# Altium schematic sheet RGB_Displays.SchDoc: Apalis Evaluation Board 1.1
size A3; Organization: Toradex AG; Address1: Altsagenstrasse 5; Address2: Horw; Address3: 6048; Address4: Switzerland; DocumentNumber: 18; Revision: V1.1; SheetNumber: 18; SheetTotal: 32; PageSetup: Record=PageOptions|CenterHorizontal=True|CenterVertical=True|PrintScale=0.73|XCorrection=1.00|YCorrection=1.00|PrintKind=0|BorderSize=5000000|LeftOffset=0|BottomOffset=0|Orientation=2|PaperLength=1000|PaperWidth=1000|Scale=100|PaperSource=7|PrintQuality=-4|MediaType=1|DitherType=10|PaperKind=A4|PrintScaleMode=1
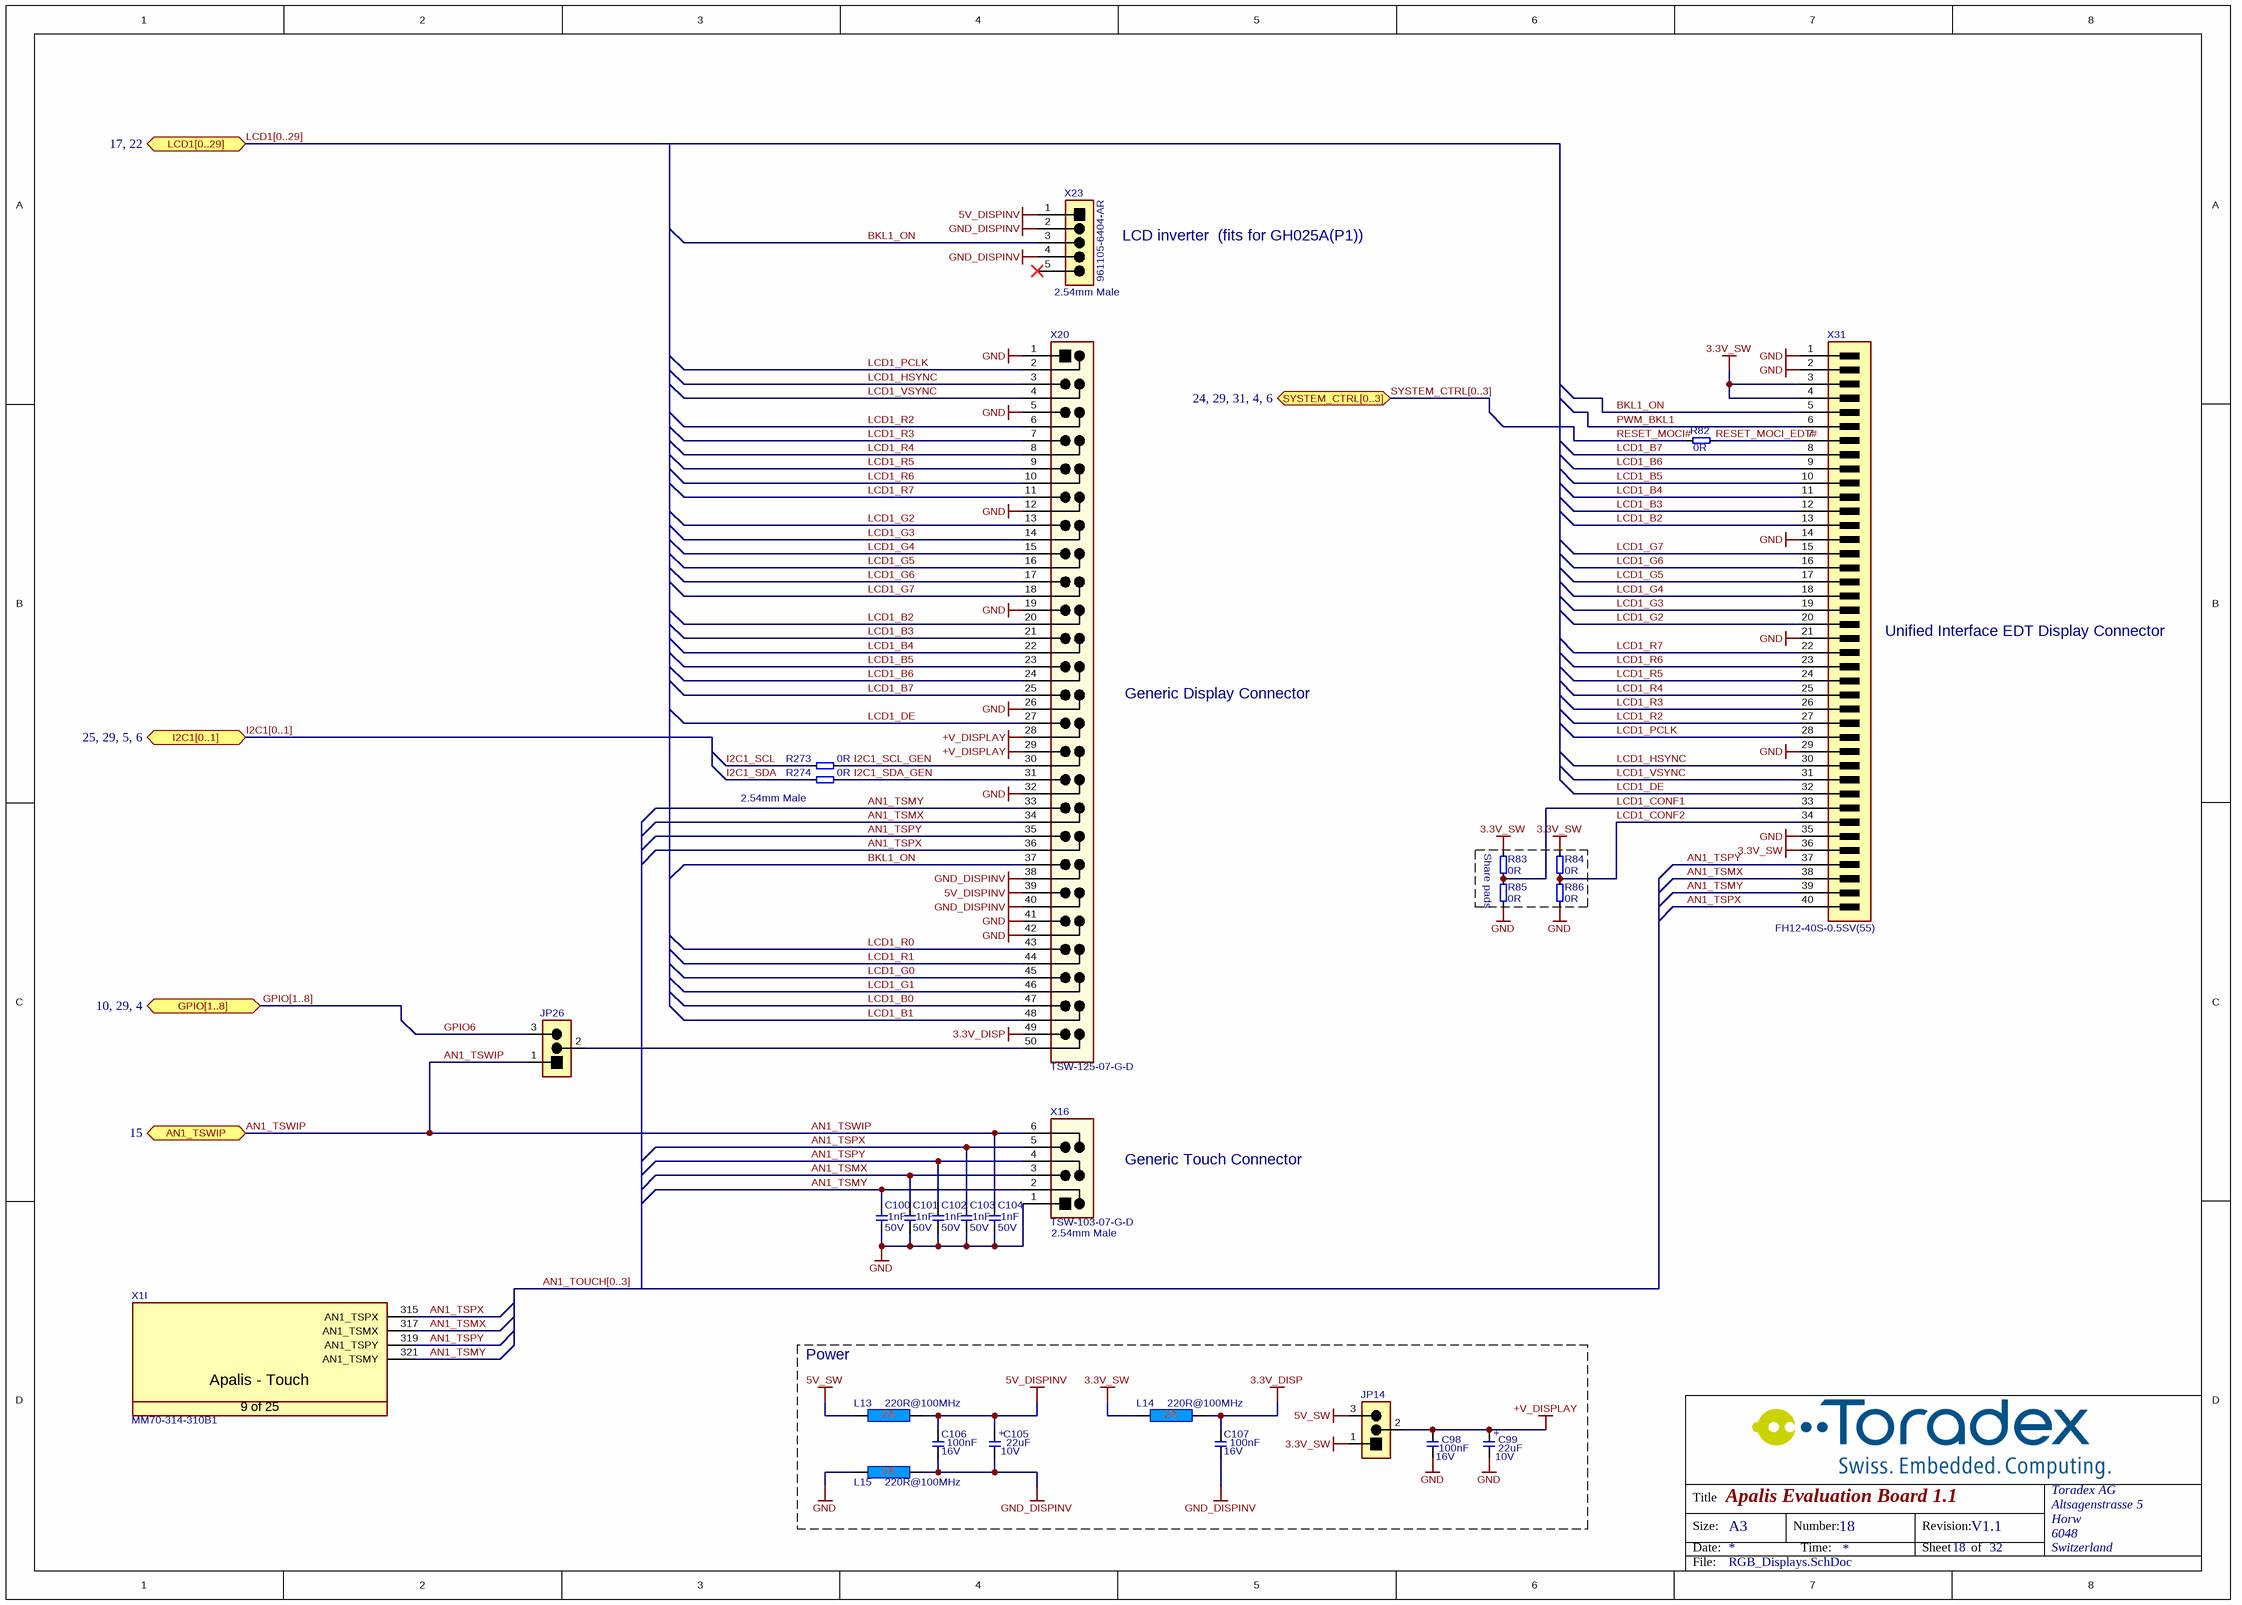
[diagram p0: RGB_Displays.SchDoc]

## Parts
C98  Rating: 16V  [T_CAPC0603X33N]  (hidden comment: 100nF)
C99  Rating: 10V  [CAPMP3528X210N]  (hidden comment: 22uF)
C100  Rating: 50V  [T_CAPC0603X33N]  (hidden comment: 1nF)
C101  Rating: 50V  [T_CAPC0603X33N]  (hidden comment: 1nF)
C102  Rating: 50V  [T_CAPC0603X33N]  (hidden comment: 1nF)
C103  Rating: 50V  [T_CAPC0603X33N]  (hidden comment: 1nF)
C104  Rating: 50V  [T_CAPC0603X33N]  (hidden comment: 1nF)
C105  Rating: 10V  [CAPMP3528X210N]  (hidden comment: 22uF)
C106  Rating: 16V  [T_CAPC0603X33N]  (hidden comment: 100nF)
C107  Rating: 16V  [T_CAPC0603X33N]  (hidden comment: 100nF)
JP14  826936-3  [T_TYCO_826936-3]  (value not drawn)
JP26  826936-3  [T_TYCO_826936-3]  (value not drawn)
L13  220R@100MHz  [INDC1608X95N]
L14  220R@100MHz  [INDC1608X95N]
L15  220R@100MHz  [INDC1608X95N]
R82  0R  [T_RESC0603X30N]
R83  0R  [T_RESC0603X30N]
R84  0R  [T_RESC0603X30N]
R85  0R  [T_RESC0603X30N]
R86  0R  [T_RESC0603X30N]
R273  0R  [T_RESC0603X30N]
R274  0R  [T_RESC0603X30N]
X1  Manufacturer Part No.: MM70-314-310B1  [T_JAE_MM70-314-310B1]  (hidden comment: CON-JAE-MM70-314-310B1-314-0.5mm)  (part I of 25)
X16  TSW-103-07-G-D  [T_Samtec_TSW-103-07-G-D]
X20  TSW-125-07-G-D  [T_SAMTEC_TSW-125-07-G-D]
X23  961105-6404-AR  [T_3M_961105-6404-AR]
X31  FH12-40S-0.5SV(55)  [T_Hirose_FH12-40S-0.5SV(55)]

## Blocks framed on the sheet
Share pads: R83-R86
Power: C98 C99 C105-C107 JP14 L13-L15

## Ports
AN1_TSWIP (bidir, see 15), GPIO[1..8] (bidir, see 10, 29, 4), I2C1[0..1] (bidir, see 25, 29, 5, 6), LCD1[0..29] (bidir, see 17, 22), SYSTEM_CTRL[0..3] (bidir, see 24, 29, 31, 4, 6)

## Nets
3.3V_DISP: C107.2 L14.2 X20.49
3.3V_SW: JP14.1 L14.1 R83.1 R84.1 X31.3(VCC) X31.4(VCC) X31.36(VDD)
5V_DISPINV: C105.1 C106.2 L13.2 X20.39 X23.1
5V_SW: JP14.3 L13.1
+V_DISPLAY: C98.2 C99.1 JP14.2 X20.28 X20.29
GND: C98.1 C99.2 C100.1 C101.1 C102.1 C103.1 C104.1 L15.1 R85.2 R86.1 X16.1 X20.1 X20.5 X20.12 X20.19 X20.26 X20.32 X20.41 X20.42 X31.1(VSS) X31.2(VSS) X31.14(VSS) X31.21(VSS) X31.29(VSS) X31.35(VSS)
GND_DISPINV: C105.2 C106.1 C107.1 L15.2 X20.38 X20.40 X23.2 X23.4
AN1_TSMX: C101.2 X1.317(AN1_TSMX) X16.3 X20.34 X31.38(XR)
AN1_TSMY: C100.2 X1.321(AN1_TSMY) X16.2 X20.33 X31.39(YD)
AN1_TSPX: C103.2 X1.315(AN1_TSPX) X16.5 X20.36 X31.40(XL)
AN1_TSPY: C102.2 X1.319(AN1_TSPY) X16.4 X20.35 X31.37(YU)
AN1_TSWIP: C104.2 JP26.1 X16.6 ; port AN1_TSWIP
BKL1_ON: X20.37 X23.3 X31.5(PWCTRL)
GPIO6: JP26.3
I2C1_SCL: R273.1
I2C1_SCL_GEN: R273.2 X20.30
I2C1_SDA: R274.1
I2C1_SDA_GEN: R274.2 X20.31
LCD1_B0: X20.47
LCD1_B1: X20.48
LCD1_B2: X20.20 X31.13(B0)
LCD1_B3: X20.21 X31.12(B1)
LCD1_B4: X20.22 X31.11(B2)
LCD1_B5: X20.23 X31.10(B3)
LCD1_B6: X20.24 X31.9(B4)
LCD1_B7: X20.25 X31.8(B5)
LCD1_CONF1: R83.2 R85.1 X31.33(NC)
LCD1_CONF2: R84.2 R86.2 X31.34(SHUT)
LCD1_DE: X20.27 X31.32(ENB)
LCD1_G0: X20.45
LCD1_G1: X20.46
LCD1_G2: X20.13 X31.20(G0)
LCD1_G3: X20.14 X31.19(G1)
LCD1_G4: X20.15 X31.18(G2)
LCD1_G5: X20.16 X31.17(G3)
LCD1_G6: X20.17 X31.16(G4)
LCD1_G7: X20.18 X31.15(G5)
LCD1_HSYNC: X20.3 X31.30(HSYNC)
LCD1_PCLK: X20.2 X31.28(DCLK)
LCD1_R0: X20.43
LCD1_R1: X20.44
LCD1_R2: X20.6 X31.27(R0)
LCD1_R3: X20.7 X31.26(R1)
LCD1_R4: X20.8 X31.25(R2)
LCD1_R5: X20.9 X31.24(R3)
LCD1_R6: X20.10 X31.23(R4)
LCD1_R7: X20.11 X31.22(R5)
LCD1_VSYNC: X20.4 X31.31(VSYNC)
PWM_BKL1: X31.6(LEDCTRL)
RESET_MOCI#: R82.1
RESET_MOCI_EDT#: R82.2 X31.7(RESET#)
NetJP26_2: JP26.2 X20.50

Not connected (* = marked no-connect by the designer): X23 5*

## Buses and harness runs
bus AN1_TOUCH[0..3]
bus GPIO[1..8] = port GPIO[1..8]
bus I2C1[0..1] = port I2C1[0..1]
bus LCD1[0..29] = port LCD1[0..29]
bus SYSTEM_CTRL[0..3] = port SYSTEM_CTRL[0..3]

## Notes on the sheet
- (near X23) LCD inverter  (fits for GH025A(P1))
- (near X23) 2.54mm Male
- (near X31) Unified Interface EDT Display Connector
- Generic Display Connector
- 2.54mm Male
- Generic Touch Connector
- (near X16) 2.54mm Male
- Title
- Size:
- Date:
- A3
- Number:
- Time:
- Revision:
- Sheet
- of
- File:
- (in symbol C-TA-22uF-10V-20%-3528) +
- (in symbol CON-JAE-MM70-314-310B1-314-0.5mm, part I) Apalis - Touch; 9 of 25

## Library data of the parts
C98 C106 C107 = C-X7R-100nF-16V-10%-0603: Capacitor Ceramic X7R 100nF 16V 10% 0603; Tolerance: 10%; Type: X7R; Value: 100nF
C99 C105 = C-TA-22uF-10V-20%-3528: Capacitor TA 22uF 10V 20% 3528; Tolerance: 20%; Type: TA; Value: 22uF
C100-C104 = C-X7R-1nF-50V-10%-0603: Capacitor Ceramic X7R 1nF 50V 10% 0603; Tolerance: 10%; Type: X7R; Value: 1nF
JP14 = CON-Tyco-826936-3-1X3-2.54mm-JP: Jumper, 3-Pin; Manufacturer Name: Tyco; No. of ways: 1X3; Pitch: 2.54mm; Manufacturer Part No.: 826936-3
JP26 = CON-Tyco-826936-3-1X3-2.54mm-JP_1: Jumper, 3-Pin; Manufacturer Name: Tyco; No. of ways: 1X3; Pitch: 2.54mm; Manufacturer Part No.: 826936-3
L13-L15 = L-220R@100MHz-2A-25%-0603: 220R@100MHz 2A EMI FILTER; Tolerance: 25%; Rating: 2A; Value: 220R@100MHz
R82-R86 R273 R274 = R-0R-63mW-1%-0603: Resistor 0 ohm 63mW 1% 0603; Rating: 63mW; Tolerance: 1%; Value: 0R
X1 = CON-JAE-MM70-314-310B1-314-0.5mm: MXM3 Connector; Manufacturer Name: JAE; No. of ways: 314
X16 = CON-Samtec-TSW-103-07-G-D: Header Male, 2x3 Pins, 2.54mm pitch; Manufacturer Name: Samtec; No. of. ways: 2x3; Pitch: 2.54mm; Manufacturer Part No.: TSW-103-07-G-D
X20 = CON-Samtec-TSW-125-07-G-D: Header, 2x25 Pins, 2.54 mm pitch; Manufacturer Name: Samtec; Pitch: 2.54mm; No. of ways: 2x25; Manufacturer Part No.: TSW-125-07-G-D
X23 = CON-3M-961105-6404-AR: Audio Header 5 pins 2.54mm; Manufacturer Name: 3M; No. of ways: 1X5; Pitch: 2.54mm; Manufacturer Part No.: 961105-6404-AR
X31 = CON-Hirose-FH12-40S-0.5SV(55)-0.5mm: 0.50mm Pitch FFC/FPC Vertical RGB connector; Manufacturer Name: Hirose; No. of ways: 24; Pitch: 0.5mm; Manufacturer Part No.: FH12-40S-0.5SV(55)